# Altium schematic sheet EC_Sensor1.SchDoc
size 419 x 296 mm; SheetNumber: 4; SheetTotal: 5
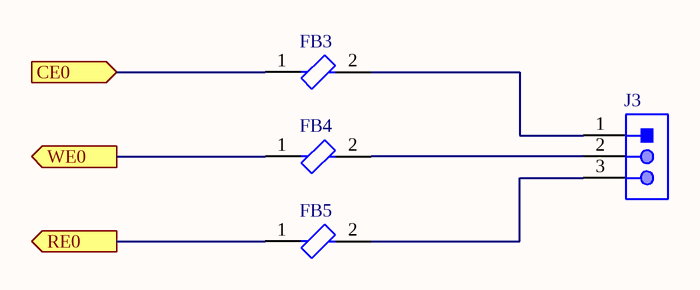
[diagram p0: EC_Sensor1.SchDoc]

## Parts
FB3  BLM15PD600SN1D  [FP-BLM15-0_05-d0_7-IPC_B]  (value not drawn)
FB4  BLM15PD600SN1D  [FP-BLM15-0_05-d0_7-IPC_B]  (value not drawn)
FB5  BLM15PD600SN1D  [FP-BLM15-0_05-d0_7-IPC_B]  (value not drawn)
J3  61300311021  [61300311021]  (value not drawn)

## Ports
CE0 (in), RE0 (out), WE0 (out)

## Nets
CE0: FB3.1 ; port CE0
RE0: FB5.1 ; port RE0
WE0: FB4.1 ; port WE0
NetFB3_2: FB3.2 J3.1
NetFB4_2: FB4.2 J3.2
NetFB5_2: FB5.2 J3.3

## Notes on the sheet
- Title
- Revision
- Project
- Approver
- Date
- Branch
- File

## Library data of the parts
FB3-FB5 = CMP-0686-00129-3: Chip Ferrite Bead, 0402, 60Ω @ 100MHz, 0.06Ω, 25%, 1.7A; Number of Circuits: 1; DC Resistance (DCR): 60mR; Material: Steel; Impedance: 60R; Test Frequency: 100MHz; Lead Free: Lead Free; Radiation Hardening: No; Min Operating Temperature: -55°C; Case Code (Metric): 1005; Series: BLM15PD; Max Current Rating: 1.7A; Length: 1mm; Tolerance: 25%; Current Rating: 1.7A; RoHS Compliant: Yes; DC Current: 1.7A; Width: 0.5mm; Core Material: Ferrite; Number of Pins: 2; Depth: 0.55mm; Case Code (Imperial): 0402; Number of Lines: 1; Package Quantity: 1; Max Operating Temperature: 125°C; Case/Package: 0402; Termination: SMD/SMT; Packaging: Tape and Reel; Height: 0.5mm; Military Standard: Not; REACH SVHC: No SVHC; Max DC Current: 1.7A; DC Resistance-Max: 60MR
J3 = CMP-1502-01061-1: THT Angled Pin Header WR-PHD, Pitch 2.54 mm, Single Row, 3 pins; Manufacturer: Wurth Elektronik; Pitch: 2.54mm; Contact Resistance: 20mOhm; Gender: Male; Pin Number: 3; Rated Current: 3A; Working Voltage: 250VAC; Withstanding Voltage: 500VAC; Package Reference: 61300311021; Manufacturer URL: http://www.we-online.de; Datasheet URL: https://katalog.we-online.de/em/datasheet/6130xx11021.pdf; Row Number: Single; Operating Temperature: -40to105degC; Publisher: WurthElektronik; Orientation: Angled; Mounting Technology: THT; Part Number: 61300311021; Packaging: Bag